# Altium schematic sheet PHY SFC.SchDoc: C-F-U-Bridge
size A3; ApprovedBy: Luca Schenetti; CheckedBy: Luca Schenetti; Author: Luca Schenetti; Engineer: Luca Schenetti; Revision: A; SheetNumber: 3; SheetTotal: 7
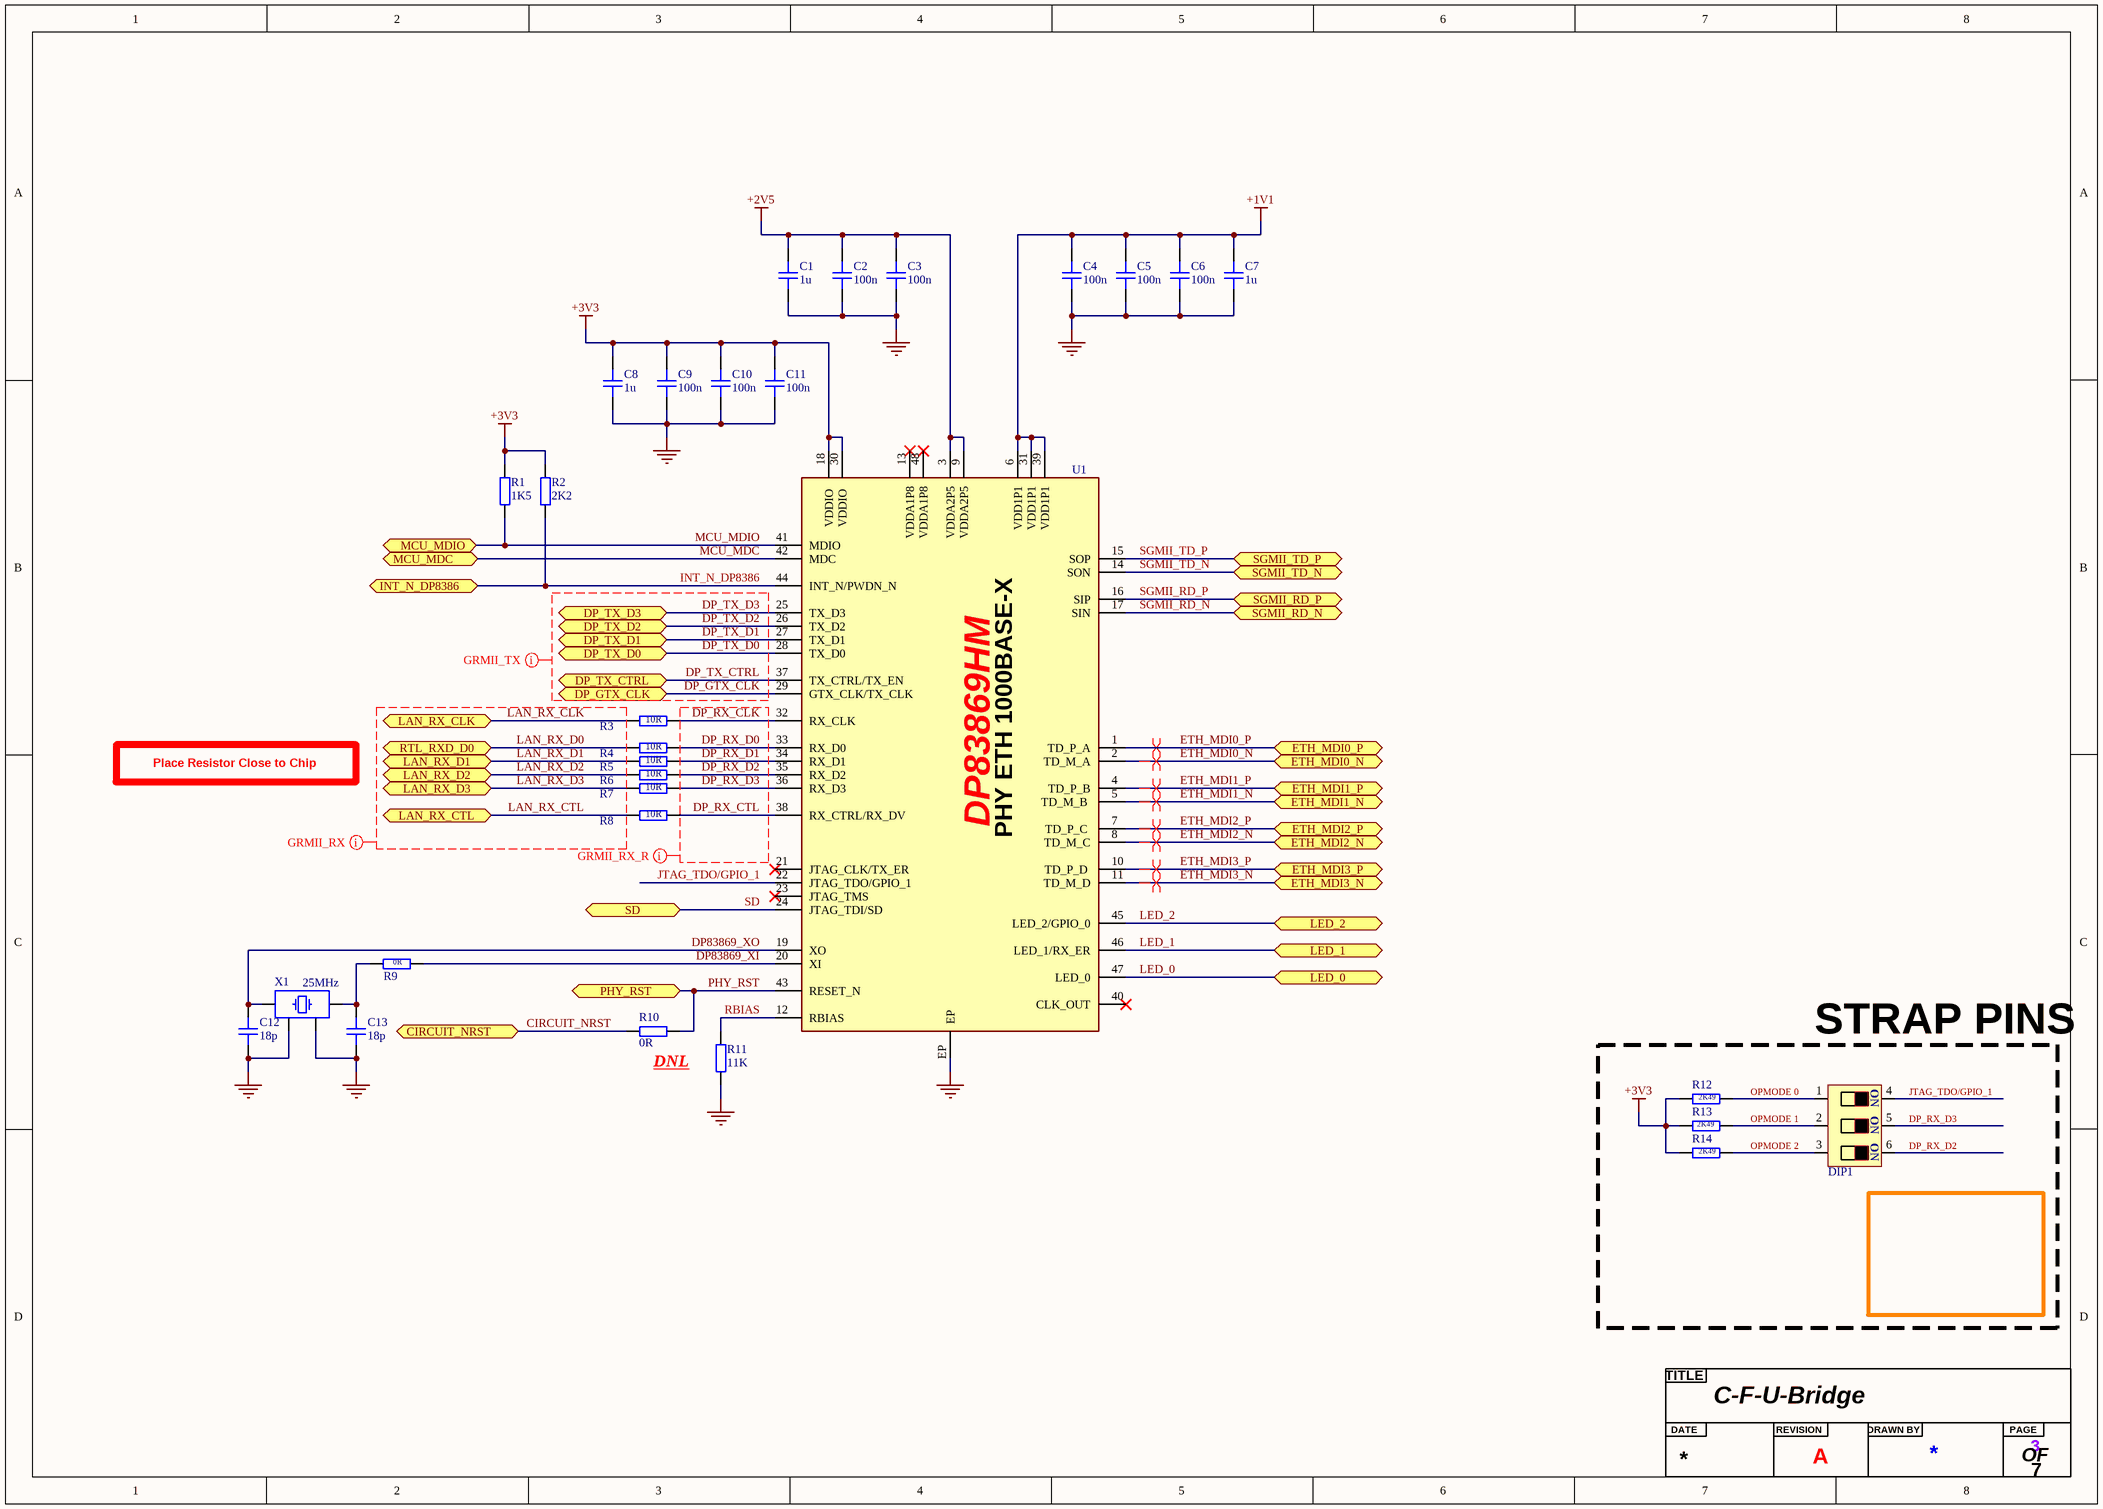
[diagram p0: PHY SFC.SchDoc]

## Parts
?  Title  (value not drawn)  (graphical)
C1  1u  [CAP_0603]
C2  100n  [CAP_0603]
C3  100n  [CAP_0603]
C4  100n  [CAP_0603]
C5  100n  [CAP_0603]
C6  100n  [CAP_0603]
C7  1u  [CAP_0603]
C8  1u  [CAP_0603]
C9  100n  [CAP_0603]
C10  100n  [CAP_0603]
C11  100n  [CAP_0603]
C12  18p  [CAP_0402]
C13  18p  [CAP_0402]
DIP1  3 POS DIP SWITCH  [DSWB03LHGET]  (value not drawn)
R1  1K5  [RES_0603]
R2  2K2  [RES_0603]
R3  10R  [RES_0402]
R4  10R  [RES_0402]
R5  10R  [RES_0402]
R6  10R  [RES_0402]
R7  10R  [RES_0402]
R8  10R  [RES_0402]
R9  0R  [RES_0402]
R10  0R  [RES_0603]  (no BOM)
R11  11K  [RES_0603]
R12  2K49  [RES_0603]
R13  2K49  [RES_0603]
R14  2K49  [RES_0603]
U1  PHY ETH 1000BASE-X/1000BASE-T  [DP83869HMRGZT]  (value not drawn)
X1  25MHz  [XTAL_3225]

## Blocks framed on the sheet
STRAP PINS: DIP1 R12-R14

## Ports
CIRCUIT_NRST (bidir, see RGMII USB[3D], STM32 MCU[7A]), DP_GTX_CLK (bidir, see RGMII USB[2C]), DP_TX_CTRL (bidir, see RGMII USB[2C]), DP_TX_D0 (bidir, see RGMII USB[2C]), DP_TX_D1 (bidir, see RGMII USB[2C]), DP_TX_D2 (bidir, see RGMII USB[2C]), DP_TX_D3 (bidir, see RGMII USB[2C]), ETH_MDI0_N (bidir, see PHY SFC CONN[1C]), ETH_MDI0_P (bidir, see PHY SFC CONN[1C]), ETH_MDI1_N (bidir, see PHY SFC CONN[1C]), ETH_MDI1_P (bidir, see PHY SFC CONN[1C]), ETH_MDI2_N (bidir, see PHY SFC CONN[1C]), ETH_MDI2_P (bidir, see PHY SFC CONN[1C]), ETH_MDI3_N (bidir, see PHY SFC CONN[1C]), ETH_MDI3_P (bidir, see PHY SFC CONN[1C]), INT_N_DP8386 (bidir, see STM32 MCU[2C]), LAN_RX_CLK (bidir, see RGMII USB[3C]), LAN_RX_CTL (bidir, see RGMII USB[3C]), LAN_RX_D1 (bidir, see RGMII USB[3C]), LAN_RX_D2 (bidir, see RGMII USB[3C]), LAN_RX_D3 (bidir, see RGMII USB[3C]), LED_0 (bidir, see PHY SFC CONN[5A]), LED_1 (bidir, see PHY SFC CONN[6B]), LED_2 (bidir, see PHY SFC CONN[5A]), MCU_MDC (bidir, see STM32 MCU[4C]), MCU_MDIO (bidir, see STM32 MCU[4C]), PHY_RST (bidir, see RGMII USB[3D]), RTL_RXD_D0 (bidir, see RGMII USB[3C]), SD (bidir, see PHY SFC CONN[4B]), SGMII_RD_N (bidir, see PHY SFC CONN[1B]), SGMII_RD_P (bidir, see PHY SFC CONN[1B]), SGMII_TD_N (bidir, see PHY SFC CONN[1B]), SGMII_TD_P (bidir, see PHY SFC CONN[1B])

## Nets
+1V1: C4.2 C5.2 C6.2 C7.2 U1.6(VDD1P1) U1.31(VDD1P1) U1.39(VDD1P1)
+2V5: C1.2 C2.2 C3.2 U1.3(VDDA2P5) U1.9(VDDA2P5)
+3V3: C8.2 C9.2 C10.2 C11.2 R1.2 R2.2 R12.2 R13.2 R14.2 U1.18(VDDIO) U1.30(VDDIO)
GND: C1.1 C2.1 C3.1 C4.1 C5.1 C6.1 C7.1 C8.1 C9.1 C10.1 C11.1 C12.1 C13.1 R11.1 U1.EP X1.2 X1.4
CIRCUIT_NRST: R10.1 ; port CIRCUIT_NRST
DP83869_XI: R9.2 U1.20(XI)
DP83869_XO: C12.2 U1.19(XO) X1.3
DP_GTX_CLK: U1.29(GTX_CLK/TX_CLK) ; port DP_GTX_CLK
DP_RX_CLK: R3.2 U1.32(RX_CLK)
DP_RX_CTL: R8.2 U1.38(RX_CTRL/RX_DV)
DP_RX_D0: R4.2 U1.33(RX_D0)
DP_RX_D1: R5.2 U1.34(RX_D1)
DP_RX_D2: DIP1.6 R6.2 U1.35(RX_D2)
DP_RX_D3: DIP1.5 R7.2 U1.36(RX_D3)
DP_TX_CTRL: U1.37(TX_CTRL/TX_EN) ; port DP_TX_CTRL
DP_TX_D0: U1.28(TX_D0) ; port DP_TX_D0
DP_TX_D1: U1.27(TX_D1) ; port DP_TX_D1
DP_TX_D2: U1.26(TX_D2) ; port DP_TX_D2
DP_TX_D3: U1.25(TX_D3) ; port DP_TX_D3
ETH_MDI0_N: U1.2(TD_M_A) ; port ETH_MDI0_N
ETH_MDI0_P: U1.1(TD_P_A) ; port ETH_MDI0_P
ETH_MDI1_N: U1.5(TD_M_B) ; port ETH_MDI1_N
ETH_MDI1_P: U1.4(TD_P_B) ; port ETH_MDI1_P
ETH_MDI2_N: U1.8(TD_M_C) ; port ETH_MDI2_N
ETH_MDI2_P: U1.7(TD_P_C) ; port ETH_MDI2_P
ETH_MDI3_N: U1.11(TD_M_D) ; port ETH_MDI3_N
ETH_MDI3_P: U1.10(TD_P_D) ; port ETH_MDI3_P
INT_N_DP8386: R2.1 U1.44(INT_N/PWDN_N) ; port INT_N_DP8386
JTAG_TDO/GPIO_1: DIP1.4 U1.22(JTAG_TDO/GPIO_1)
LAN_RX_CLK: R3.1 ; port LAN_RX_CLK
LAN_RX_CTL: R8.1 ; port LAN_RX_CTL
LAN_RX_D0: R4.1 ; port RTL_RXD_D0
LAN_RX_D1: R5.1 ; port LAN_RX_D1
LAN_RX_D2: R6.1 ; port LAN_RX_D2
LAN_RX_D3: R7.1 ; port LAN_RX_D3
LED_0: U1.47(LED_0) ; port LED_0
LED_1: U1.46(LED_1/RX_ER) ; port LED_1
LED_2: U1.45(LED_2/GPIO_0) ; port LED_2
MCU_MDC: U1.42(MDC) ; port MCU_MDC
MCU_MDIO: R1.1 U1.41(MDIO) ; port MCU_MDIO
OPMODE 0: DIP1.1 R12.1
OPMODE 1: DIP1.2 R13.1
OPMODE 2: DIP1.3 R14.1
PHY_RST: R10.2 U1.43(RESET_N) ; port PHY_RST
RBIAS: R11.2 U1.12(RBIAS)
SD: U1.24(JTAG_TDI/SD) ; port SD
SGMII_RD_N: U1.17(SIN) ; port SGMII_RD_N
SGMII_RD_P: U1.16(SIP) ; port SGMII_RD_P
SGMII_TD_N: U1.14(SON) ; port SGMII_TD_N
SGMII_TD_P: U1.15(SOP) ; port SGMII_TD_P
NetC13_2: C13.2 R9.1 X1.1

Not connected (* = marked no-connect by the designer): U1 13(VDDA1P8)* 21(JTAG_CLK/TX_ER)* 23(JTAG_TMS)* 40(CLK_OUT)* 48(VDDA1P8)*

## Layout directives
differential pair; differential pair class DIFF_MDI_100Ω; rule Matched Net Lengths [Delay Tolerance = 50ps]: ETH_MDI0_N, ETH_MDI0_P, ETH_MDI1_N, ETH_MDI1_P, ETH_MDI2_N, ETH_MDI2_P, ETH_MDI3_N, ETH_MDI3_P
net class GRMII_RX_R; rule Matched Net Lengths [Delay Tolerance = 20ps]: DP_RX_CLK, DP_RX_CTL, DP_RX_D0, DP_RX_D1, DP_RX_D2, DP_RX_D3
net class GRMII_TX; rule Matched Net Lengths [Delay Tolerance = 20ps]: DP_GTX_CLK, DP_TX_CTRL, DP_TX_D0, DP_TX_D1, DP_TX_D2, DP_TX_D3
net class GRMII_RX; rule Matched Net Lengths [Delay Tolerance = 20ps]: LAN_RX_CLK, LAN_RX_CTL, LAN_RX_D0, LAN_RX_D1, LAN_RX_D2, LAN_RX_D3

## Notes on the sheet
- Place Resistor Close to Chip
- (near R10) DNL
- (in symbol DP83869HMRGZT) PHY ETH 1000BASE-X; DP83869HM
- (in symbol DSWB03LHGET) ON
- (in symbol Title) TITLE; DATE; REVISION; DRAWN BY; PAGE; OF

## Library data of the parts
C1 C7 C8 = CAP_0603: [C15849]; Manufacturer: *; Manufacturer Part Number: *; Distributor Link: *; LCSC: *; Rating: *; Dielectric: *
C2-C6 C9-C11 = CAP_0603: [C14663]; Manufacturer: *; Manufacturer Part Number: *; Distributor Link: *; LCSC: *; Rating: *; Dielectric: *
C12 C13 = CAP_0402: Capacitor SMD 0402 [C1549]; Manufacturer: *; Manufacturer Part Number: *; Distributor Link: *; LCSC: *; Rating: *; Dielectric: *
DIP1 = DSWB03LHGET: [C99420]
R1 = RES_0603: [C22843]; Manufacturer: *; Manufacturer Part Number: *; Distributor Link: *; LCSC: *
R2 = RES_0603: [C4190]; Manufacturer: *; Manufacturer Part Number: *; Distributor Link: *; LCSC: *
R3-R8 = RES_0402: [C25077]; Manufacturer: *; Manufacturer Part Number: *; Distributor Link: *; LCSC: *
R9 = RES_0402: Resistor SMD 0402 [C17168]; Manufacturer: *; Manufacturer Part Number: *; Distributor Link: *; LCSC: *
R10 = RES_0603: Manufacturer: *; Manufacturer Part Number: *; Distributor Link: *; LCSC: *
R11 = RES_0603: [C25950]; Manufacturer: *; Manufacturer Part Number: *; Distributor Link: *; LCSC: *
R12-R14 = RES_0603: [C22908]; Manufacturer: *; Manufacturer Part Number: *; Distributor Link: *; LCSC: *
U1 = DP83869HMRGZT: [C2671580]
X1 = TSX-3225_24.0000MF15X-AC: Crystal SMD 24MHz 10PPM 7pF 3225 [C9006]; Manufacturer: Epson; Manufacturer Part Number: TSX-3225 24.0000MF15X-AC